# EAGLE design Xonik Waveformer v1.0 (EAGLE 6.5.0)
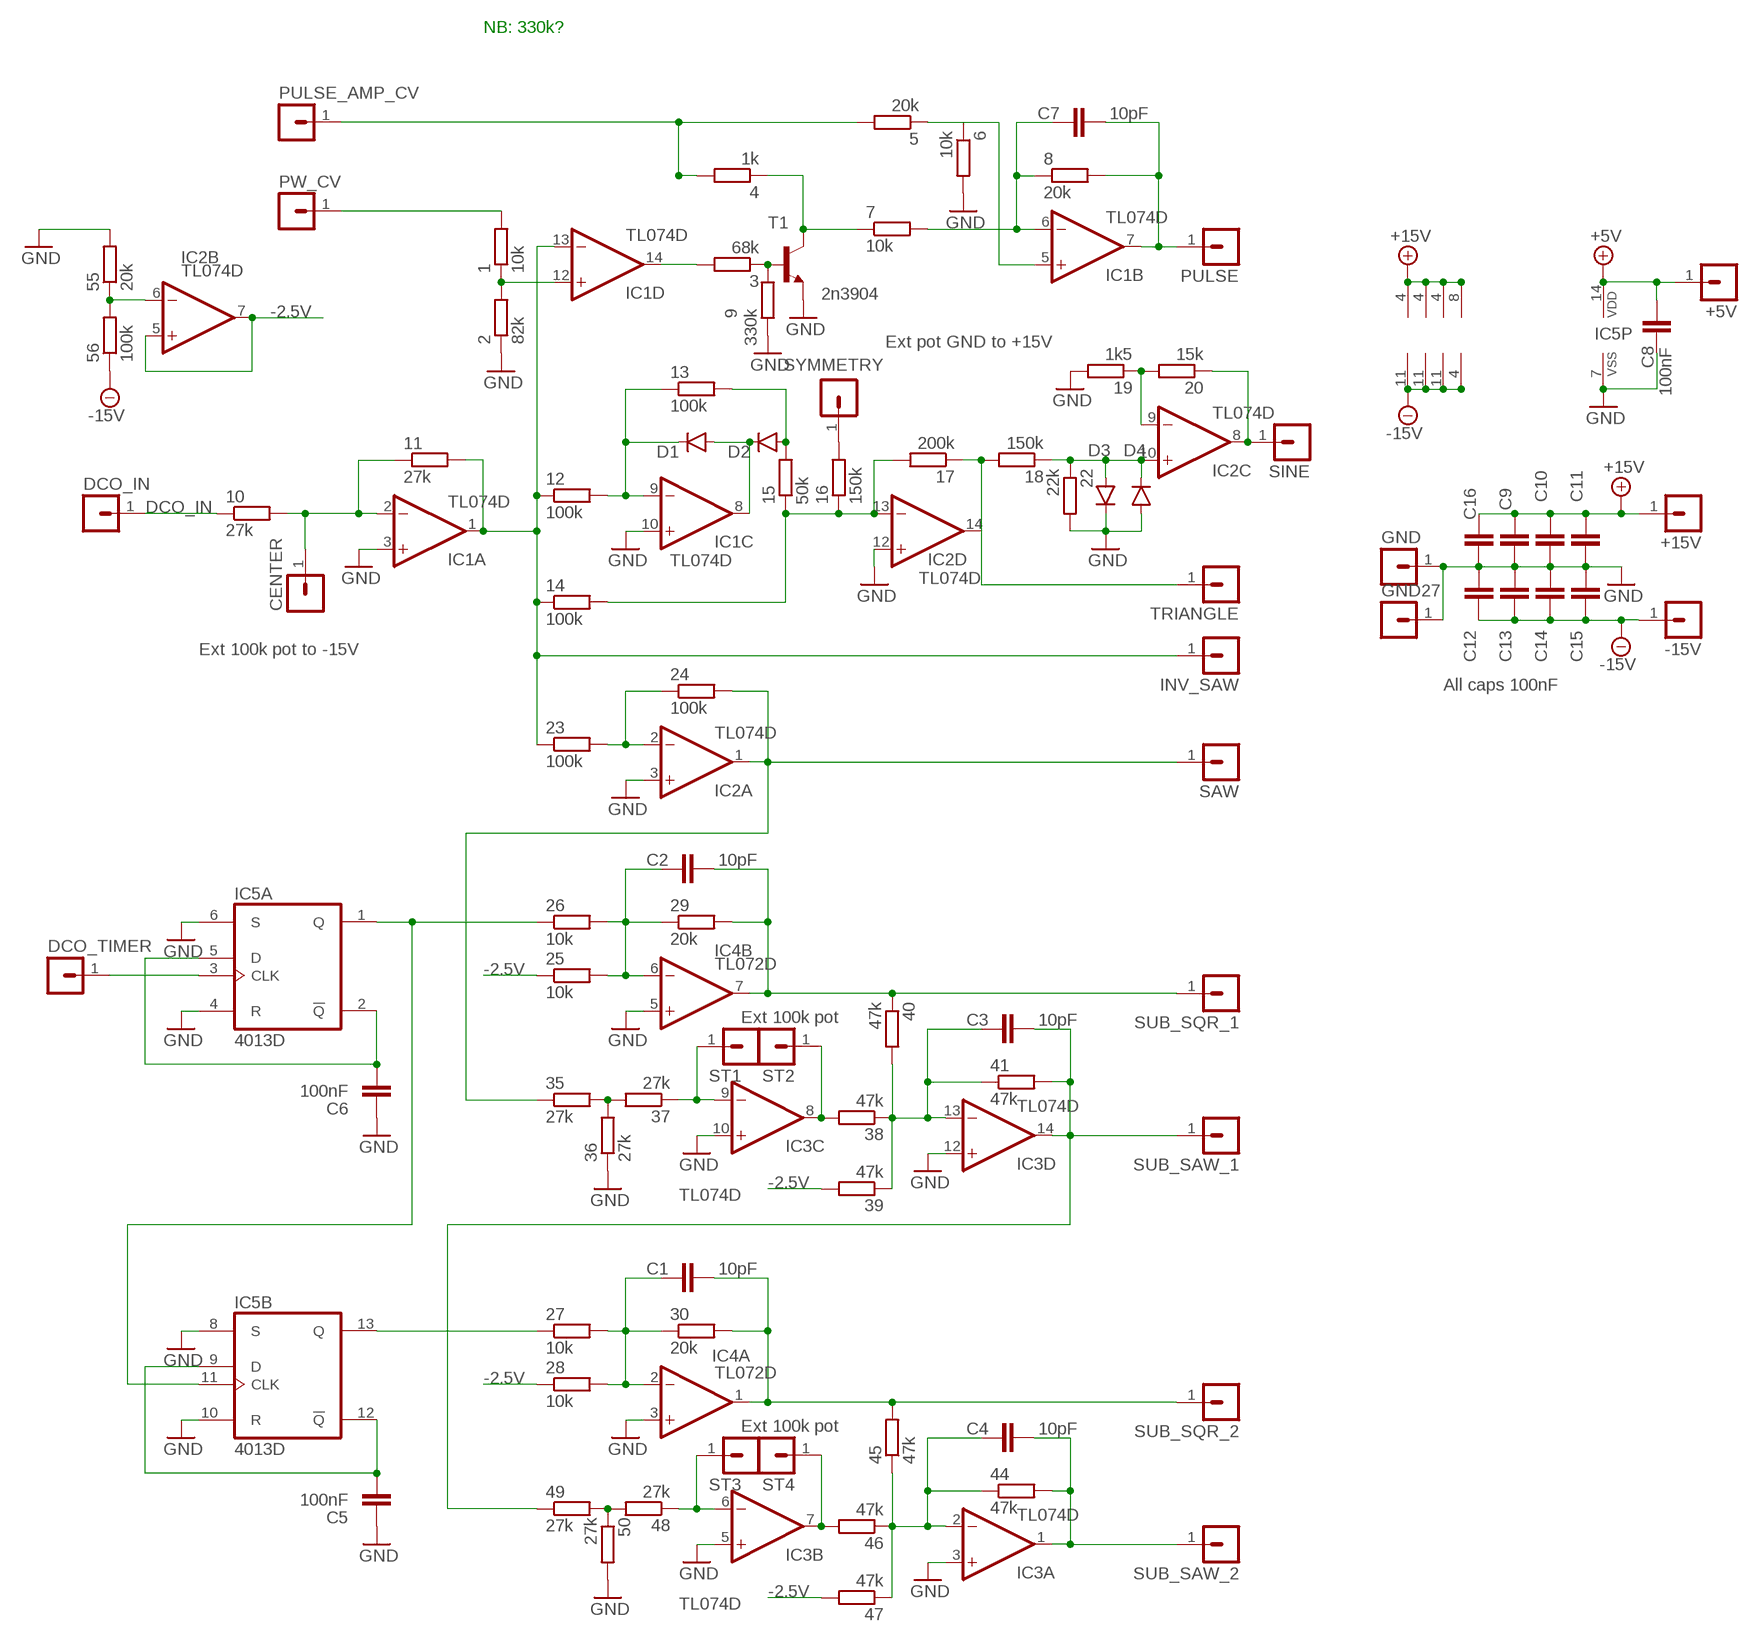
[diagram p0: schematic, sheet 1]

## Parts
1  10k  R-EU_R0805  [R0805]
2  82k  R-EU_R0805  [R0805]
3  68k  R-EU_R0805  [R0805]
4  1k  R-EU_R0805  [R0805]
5  20k  R-EU_R0805  [R0805]
6  10k  R-EU_R0805  [R0805]
7  10k  R-EU_R0805  [R0805]
8  20k  R-EU_R0805  [R0805]
9  330k  R-EU_R0805  [R0805]
10  27k  R-EU_R0805  [R0805]
11  27k  R-EU_R0805  [R0805]
12  100k  R-EU_R0805  [R0805]
13  100k  R-EU_R0805  [R0805]
14  100k  R-EU_R0805  [R0805]
15  50k  R-EU_R0805  [R0805]
16  150k  R-EU_R0805  [R0805]
17  200k  R-EU_R0805  [R0805]
18  150k  R-EU_R0805  [R0805]
19  1k5  R-EU_R0805  [R0805]
20  15k  R-EU_R0805  [R0805]
22  22k  R-EU_R0805  [R0805]
23  100k  R-EU_R0805  [R0805]
24  100k  R-EU_R0805  [R0805]
25  10k  R-EU_R0805  [R0805]
26  10k  R-EU_R0805  [R0805]
27  10k  R-EU_R0805  [R0805]
28  10k  R-EU_R0805  [R0805]
29  20k  R-EU_R0805  [R0805]
30  20k  R-EU_R0805  [R0805]
35  27k  R-EU_R0805  [R0805]
36  27k  R-EU_R0805  [R0805]
37  27k  R-EU_R0805  [R0805]
38  47k  R-EU_R0805  [R0805]
39  47k  R-EU_R0805  [R0805]
40  47k  R-EU_R0805  [R0805]
41  47k  R-EU_R0805  [R0805]
44  47k  R-EU_R0805  [R0805]
45  47k  R-EU_R0805  [R0805]
46  47k  R-EU_R0805  [R0805]
47  47k  R-EU_R0805  [R0805]
48  27k  R-EU_R0805  [R0805]
49  27k  R-EU_R0805  [R0805]
50  27k  R-EU_R0805  [R0805]
55  20k  R-EU_R0805  [R0805]
56  100k  R-EU_R0805  [R0805]
+5V  MA01-1JP  [SIP-PIN01-1J]
+15V  MA01-1JP  [SIP-PIN01-1J]
-15V  MA01-1JP  [SIP-PIN01-1J]
C1  10pF  C-EUC0805  [C0805]
C2  10pF  C-EUC0805  [C0805]
C3  10pF  C-EUC0805  [C0805]
C4  10pF  C-EUC0805  [C0805]
C5  100nF  C-EUC0805  [C0805]
C6  100nF  C-EUC0805  [C0805]
C7  10pF  C-EUC0805  [C0805]
C8  100nF  C-EUC0805  [C0805]
C9  100nF  C-EUC0603K  [C0603K]
C10  100nF  C-EUC0603K  [C0603K]
C11  100nF  C-EUC0603K  [C0603K]
C12  100nF  C-EUC0603K  [C0603K]
C13  100nF  C-EUC0603K  [C0603K]
C14  100nF  C-EUC0603K  [C0603K]
C15  100nF  C-EUC0603K  [C0603K]
C16  100nF  C-EUC0603K  [C0603K]
CENTER  MA01-1JP  [SIP-PIN01-1J]
D1  1N41480805  [D0805-J]
D2  1N41480805  [D0805-J]
D3  1N41480805  [D0805-J]
D4  1N41480805  [D0805-J]
DCO_IN  MA01-1JP  [SIP-PIN01-1J]
DCO_TIMER  MA01-1JP  [SIP-PIN01-1J]
GND  MA01-1JP  [SIP-PIN01-1J]
GND27  MA01-1JP  [SIP-PIN01-1J]
IC1  TL074D  [SO14]
IC2  TL074D  [SO14]
IC3  TL074D  [SO14]
IC4  TL072D  [SO08J]
IC5  4013D  [SO14J]
INV_SAW  MA01-1JP  [SIP-PIN01-1J]
PULSE  MA01-1JP  [SIP-PIN01-1J]
PULSE_AMP_CV  MA01-1JP  [SIP-PIN01-1J]
PW_CV  MA01-1JP  [SIP-PIN01-1J]
SAW  MA01-1JP  [SIP-PIN01-1J]
SINE  MA01-1JP  [SIP-PIN01-1J]
ST1  MA01-1JP  [SIP-PIN01-1J]
ST2  MA01-1JP  [SIP-PIN01-1J]
ST3  MA01-1JP  [SIP-PIN01-1J]
ST4  MA01-1JP  [SIP-PIN01-1J]
SUB_SAW_1  MA01-1JP  [SIP-PIN01-1J]
SUB_SAW_2  MA01-1JP  [SIP-PIN01-1J]
SUB_SQR_1  MA01-1JP  [SIP-PIN01-1J]
SUB_SQR_2  MA01-1JP  [SIP-PIN01-1J]
SYMMETRY  MA01-1JP  [SIP-PIN01-1J]
T1  2n3904  MMBT3904LT1-NPN-SOT23-BEC  [SOT23-BEC]
TRIANGLE  MA01-1JP  [SIP-PIN01-1J]

## Nets
+5V: +5V.1 C8.2 IC5.14(P:VDD)
+15V: +15V.1 C9.2 C10.2 C11.2 C16.2 IC1.4(P:V+) IC2.4(P:V+) IC3.4(P:V+) IC4.8(P:V+)
-2.5V: 25.1 28.1 39.2 47.2 IC2.5(B:+IN) IC2.7(B:OUT)
-15V: 56.1 -15V.1 C12.1 C13.1 C14.1 C15.1 IC1.11(P:V-) IC2.11(P:V-) IC3.11(P:V-) IC4.4(P:V-)
AMP_CV: 4.2 5.2 PULSE_AMP_CV.1
DCO_IN: 10.1 DCO_IN.1
GND: 2.1 6.2 9.2 19.2 22.2 36.1 50.2 55.2 C5.1 C6.1 C8.1 C9.1 C10.1 C11.1 C12.2 C13.2 C14.2 C15.2 C16.1 D3.C D4.A GND27.1 GND.1 IC1.3(A:+IN) IC1.10(C:+IN) IC2.3(A:+IN) IC2.12(D:+IN) IC3.3(A:+IN) IC3.5(B:+IN) IC3.10(C:+IN) IC3.12(D:+IN) IC4.3(A:+IN) IC4.5(B:+IN) IC5.4(A:R) IC5.6(A:S) IC5.7(P:VSS) IC5.8(B:S) IC5.10(B:R) T1.E
N$1: 1.1 2.2 IC1.12(D:+IN)
N$2: 3.2 IC1.14(D:OUT)
N$3: 3.1 9.1 T1.B
N$4: 4.1 7.1 T1.C
N$5: 5.1 6.1 IC1.5(B:+IN)
N$6: 7.2 8.1 C7.1 IC1.6(B:-IN)
N$7: 8.2 C7.2 IC1.7(B:OUT) PULSE.1
N$9: 11.2 12.1 14.1 23.1 IC1.1(A:OUT) IC1.13(D:-IN) INV_SAW.1
N$10: 10.2 11.1 CENTER.1 IC1.2(A:-IN)
N$11: 12.2 13.1 D1.C IC1.9(C:-IN)
N$12: D1.A D2.C IC1.8(C:OUT)
N$13: 13.2 15.2 D2.A
N$14: 14.2 15.1 16.1 17.2 IC2.13(D:-IN)
N$15: 23.2 24.1 IC2.2(A:-IN)
N$16: 24.2 35.1 IC2.1(A:OUT) SAW.1
N$17: 29.2 40.1 C2.2 IC4.7(B:OUT) SUB_SQR_1.1
N$18: 30.2 45.2 C1.2 IC4.1(A:OUT) SUB_SQR_2.1
N$19: 25.2 26.2 29.1 C2.1 IC4.6(B:-IN)
N$20: 46.2 IC3.7(B:OUT) ST4.1
N$21: 48.2 49.2 50.1
N$22: 27.2 28.2 30.1 C1.1 IC4.2(A:-IN)
N$23: 35.2 36.2 37.2
N$24: 37.1 IC3.9(C:-IN) ST1.1
N$26: 38.1 39.1 40.2 41.1 C3.1 IC3.13(D:-IN)
N$27: 41.2 49.1 C3.2 IC3.14(D:OUT) SUB_SAW_1.1
N$28: 48.1 IC3.6(B:-IN) ST3.1
N$29: 44.1 45.1 46.1 47.1 C4.1 IC3.2(A:-IN)
N$30: 44.2 C4.2 IC3.1(A:OUT) SUB_SAW_2.1
N$31: C6.2 IC5.2(A:!Q) IC5.5(A:D)
N$32: 26.1 IC5.1(A:Q) IC5.11(B:CLK)
N$33: 55.1 56.2 IC2.6(B:-IN)
N$34: C5.2 IC5.9(B:D) IC5.12(B:!Q)
N$35: 27.1 IC5.13(B:Q)
N$36: 19.1 20.2 IC2.9(C:-IN)
N$37: 16.2 SYMMETRY.1
N$38: 17.1 18.2 IC2.14(D:OUT) TRIANGLE.1
N$39: 18.1 22.1 D3.A D4.C IC2.10(C:+IN)
N$40: 20.1 IC2.8(C:OUT) SINE.1
N$41: 38.2 IC3.8(C:OUT) ST2.1
PW_CV: 1.2 PW_CV.1
SQR: DCO_TIMER.1 IC5.3(A:CLK)

## Notes on the sheet
- NB: 330k?
- Ext pot GND to +15V
- Ext 100k pot to -15V
- All caps 100nF
- Ext 100k pot
- Ext 100k pot

## Library data of the parts
1-20 22-30 35-41 44-50 55 56 = resistor:R-EU_: RESISTOR, European symbol
+5V +15V -15V CENTER DCO_IN DCO_TIMER GND GND27 INV_SAW PULSE PULSE_AMP_CV PW_CV SAW SINE ST1-ST4 SUB_SAW_1 SUB_SAW_2 SUB_SQR_1 SUB_SQR_2 SYMMETRY TRIANGLE = joakim:MA01-1J: PIN HEADER
C1-C16 = resistor:C-EU: CAPACITOR, European symbol
D1-D4 = joakim:1N4148: DIODE high speed (Philips)
IC1-IC3 = linear:TL074: OP AMP
IC4 = joakim:TL072: OP AMP
IC5 = joakim:4013: Dual D FLIP FLOP, set/reset
T1 = transistor-neu-to92:*-NPN-: NPN Transistror

## Board
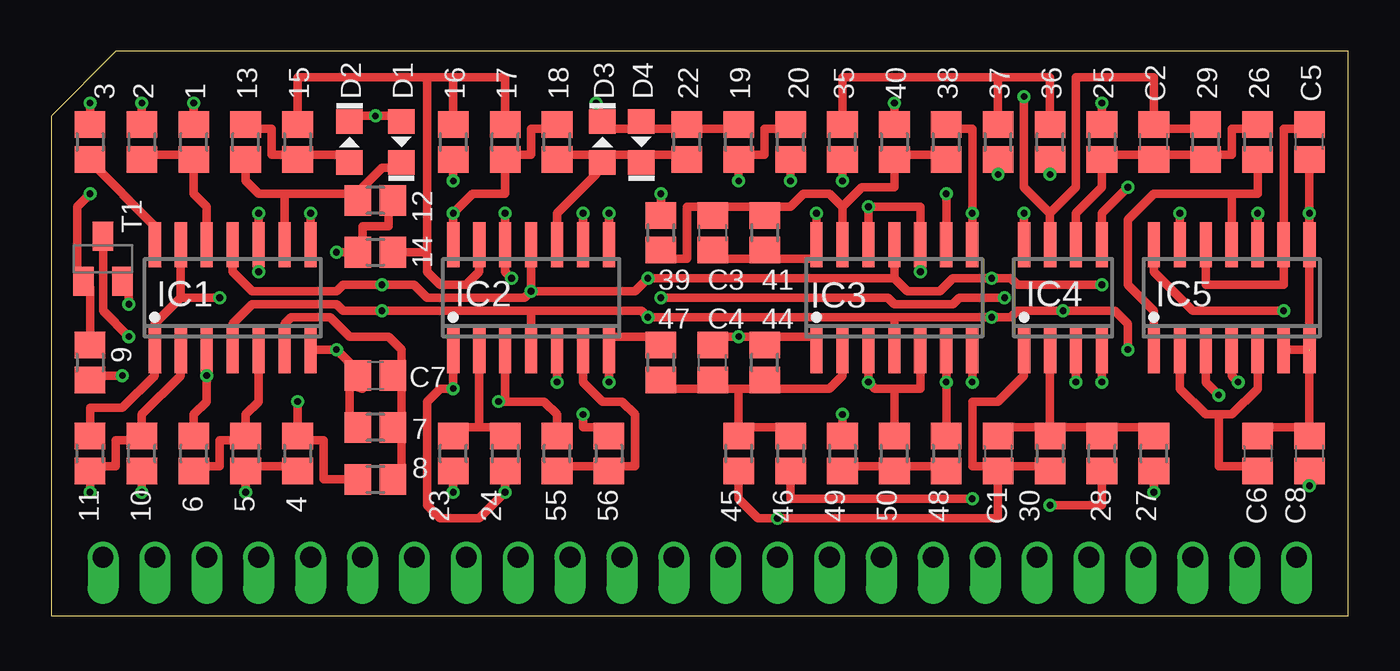
[diagram p1: board, top side]
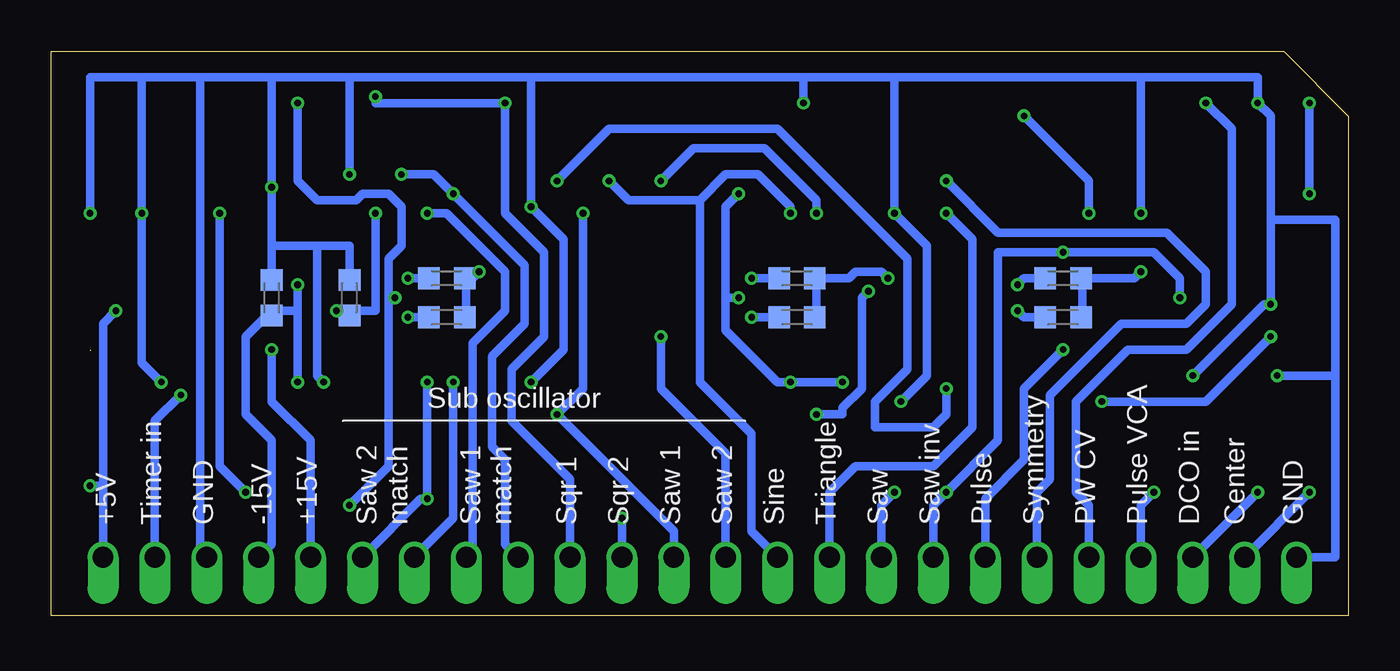
[diagram p2: board, bottom side, seen from below]

Size 63.5 x 27.62 mm. Coordinates in mm from the lower left corner, seen from the top.
Outline: 0,0 63.5,0 63.5,27.61 3.49,27.62 3.17,27.61 0,24.43 0,0
Copper layers (1*16): Top 0.035mm / dielectric 1.5mm / Bottom 0.035mm
Design rules "dirt_cheap_dirty_boards.v1": minimum track width 5mil, minimum drill 12mil, track to track 5mil, track to pad 5mil, pad to pad 5mil, via to via 5mil, smd to smd 0mil, copper to edge 10mil, drill to drill 10mil, minimum pad ring 10mil, minimum via ring 6mil, stop-mask expansion 2mil, vias tented up to drill 25mil, thermal gap 10mil

### Footprints (pad centres in the part's own frame; a part is rotated, then mirrored left to right if it is on the bottom)
R0805 = smd 1.3 x 1.5: 1 -0.85,0; 2 0.85,0
SIP-PIN01-1J = drill 1.016 offset: 1 0,0
C0805 = smd 1.3 x 1.5: 1 -0.85,0; 2 0.85,0
C0603K = smd 1.05 x 1.08: 1 -0.875,0; 2 0.875,0
D0805-J = smd 1.2 x 1.3: A -1,0; C 1,0
SO14 = smd 0.6 x 2.2: 1 -3.81,-2.6; 2 -2.54,-2.6; 3 -1.27,-2.6; 4 0,-2.6; 5 1.27,-2.6; 6 2.54,-2.6; 7 3.81,-2.6; 8 3.81,2.6; 9 2.54,2.6; 10 1.27,2.6; 11 0,2.6; 12 -1.27,2.6; 13 -2.54,2.6; 14 -3.81,2.6
SO08J = smd 0.6 x 2.2: 1 -1.905,-2.6; 2 -0.635,-2.6; 3 0.635,-2.6; 4 1.905,-2.6; 5 1.905,2.6; 6 0.635,2.6; 7 -0.635,2.6; 8 -1.905,2.6
SO14J = smd 0.6 x 2.2: 1 -3.81,-2.6; 2 -2.54,-2.6; 3 -1.27,-2.6; 4 0,-2.6; 5 1.27,-2.6; 6 2.54,-2.6; 7 3.81,-2.6; 8 3.81,2.6; 9 2.54,2.6; 10 1.27,2.6; 11 0,2.6; 12 -1.27,2.6; 13 -2.54,2.6; 14 -3.81,2.6
SOT23-BEC = smd 1 x 1.4: B -0.95,-1.1; C 0,1.1; E 0.95,-1.1

### Placement (x,y rotation side)
1  6.99,23.18 90 top
2  4.45,23.18 270 top
3  1.91,23.18 270 top
4  12.06,7.94 270 top
5  9.53,7.94 270 top
6  6.99,7.94 90 top
7  15.88,6.67 0 top
8  15.88,9.21 180 top
9  1.91,12.38 270 top
10  4.45,7.94 90 top
11  1.91,7.94 90 top
12  15.88,20.32 180 top
13  9.53,23.18 90 top
14  15.88,17.78 0 top
15  12.06,23.18 270 top
16  19.68,23.18 270 top
17  22.23,23.18 90 top
18  24.77,23.18 90 top
19  33.66,23.18 90 top
20  36.2,23.18 90 top
22  31.11,23.18 90 top
23  19.68,7.94 90 top
24  22.23,7.94 270 top
25  51.44,23.18 270 top
26  59.05,23.18 90 top
27  53.98,7.94 90 top
28  51.44,7.94 90 top
29  56.52,23.18 90 top
30  48.9,7.94 270 top
35  38.73,23.18 90 top
36  48.9,23.18 90 top
37  46.35,23.18 90 top
38  43.81,23.18 90 top
39  29.84,18.73 90 top
40  41.27,23.18 270 top
41  34.92,18.73 270 top
44  34.92,12.38 90 top
45  33.66,7.94 270 top
46  36.2,7.94 270 top
47  29.84,12.38 90 top
48  43.81,7.94 270 top
49  38.73,7.94 270 top
50  41.27,7.94 90 top
55  24.77,7.94 90 top
56  27.3,7.94 270 top
+5V  60.96,2.86 0 top
+15V  50.8,2.86 0 top
-15V  53.34,2.86 0 top
C1  46.35,7.94 270 top
C2  53.98,23.18 90 top
C3  32.38,18.73 270 top
C4  32.38,12.38 90 top
C5  61.59,23.18 90 top
C6  59.05,7.94 270 top
C7  15.88,11.75 180 top
C8  61.59,7.94 270 top
C9  44.13,14.61 180 bottom
C10  26.99,14.61 180 bottom
C11  13.97,14.61 180 bottom
C12  52.7,15.56 90 bottom
C13  44.13,16.51 0 bottom
C14  26.99,16.51 0 bottom
C15  13.97,16.51 0 bottom
C16  48.9,15.56 270 bottom
CENTER  5.08,2.86 0 top
D1  17.14,23.18 270 top
D2  14.61,23.18 90 top
D3  26.99,23.18 90 top
D4  28.89,23.18 270 top
DCO_IN  7.62,2.86 0 top
DCO_TIMER  58.42,2.86 0 top
GND  55.88,2.86 0 top
GND27  2.54,2.86 0 top
IC1  8.89,15.56 0 top
IC2  23.5,15.56 0 top
IC3  41.27,15.56 0 top
IC4  49.53,15.56 0 top
IC5  57.78,15.56 0 top
INV_SAW  20.32,2.86 0 top
PULSE  17.78,2.86 0 top
PULSE_AMP_CV  10.16,2.86 0 top
PW_CV  12.7,2.86 0 top
SAW  22.86,2.86 0 top
SINE  27.94,2.86 0 top
ST1  40.64,2.86 0 top
ST2  43.18,2.86 0 top
ST3  45.72,2.86 0 top
ST4  48.26,2.86 0 top
SUB_SAW_1  33.02,2.86 0 top
SUB_SAW_2  30.48,2.86 0 top
SUB_SQR_1  38.1,2.86 0 top
SUB_SQR_2  35.56,2.86 0 top
SYMMETRY  15.24,2.86 0 top
T1  2.54,17.46 0 top
TRIANGLE  25.4,2.86 0 top

### Tracks (layer width: path | path; a pad name or v marks a point on that pad's centre or on a via)
+5V  (via drill 0.33)
  Top 0.406: v60.33,14.92 55.88,14.92 53.98,16.83 IC5.14 | C8.2 v61.59,6.35
  Bottom 0.406: +5V.1 60.96,6.35 | 60.96,6.35 60.96,14.29 v60.33,14.92 | v61.59,6.35 60.96,6.35
+15V  (via drill 0.33)
  Top 0.406: IC1.4 8.89,14.29 9.84,15.24 13.97,15.24 14.29,14.92 v16.19,14.92 23.5,14.92 | 23.5,14.92 28.89,14.92 v29.21,14.61 41.27,14.61 | 41.27,14.61 v46.04,14.61 46.99,14.61 47.31,14.92 v49.53,14.92 52.07,14.92 52.7,14.29 v52.7,13.02 | IC2.4 23.5,14.92 | IC3.4 41.27,14.61 | IC4.8 v47.62,19.68
  Bottom 0.406: +15V.1 50.8,8.57 52.7,10.48 v52.7,13.02 | v47.62,19.68 47.62,14.92 48.34,14.92 | 48.34,14.92 v49.53,14.92 | C11.2 15.88,14.61 v16.19,14.92 | v29.21,14.61 C10.2 | 45.09,14.92 C9.2 v46.04,14.61 | 48.34,14.92 C16.2
-2.5V  (via drill 0.33)
  Top 0.406: v29.84,15.56 40.96,15.56 41.27,15.24 44.13,15.24 44.45,15.56 v46.67,15.56 | 28.1 51.44,5.4 v48.9,5.4 | v51.44,25.08 25.1 | v27.3,11.43 IC2.7 27.3,13.65 29.84,13.65 47.2 | 39.2 v29.84,20.64 | IC2.5 v24.77,11.43
  Bottom 0.406: 30.48,15.56 30.48,20 v29.84,20.64 | v48.9,5.4 46.99,7.3 46.99,15.56 | v46.67,15.56 46.99,15.56 | 46.99,15.56 46.99,17.46 46.35,18.1 46.35,20 46.99,20.64 48.26,20.64 48.58,20.32 50.48,20.32 51.44,21.27 v51.44,25.08 | 30.48,15.56 30.48,13.97 27.94,11.43 v27.3,11.43 v24.77,11.43 | 30.48,15.56 v29.84,15.56
-15V  (via drill 0.33)
  Top 0.406: IC1.11 8.89,16.83 9.84,15.88 13.97,15.88 14.29,16.19 v16.19,16.19 17.78,16.19 18.41,15.56 23.18,15.56 v23.5,15.88 | v23.5,15.88 28.57,15.88 v29.21,16.51 41.27,16.51 | 41.27,16.51 41.91,15.88 43.5,15.88 44.13,16.51 v46.04,16.51 46.99,16.51 47.31,16.19 v51.44,16.19 | IC3.11 41.27,16.51 | IC2.11 v23.5,15.88 | 56.1 27.3,9.21 26.04,9.21 v26.04,9.84 | IC4.4 v51.44,11.43
  Bottom 0.406: v26.04,9.84 24.77,9.84 24.77,10.16 23.81,11.11 23.81,15.56 v23.5,15.88 | -15V.1 52.7,3.49 52.7,8.57 53.98,9.84 53.98,13.65 52.7,14.92 | 52.7,14.92 51.44,14.92 v51.44,16.19 v51.44,11.43 | C15.1 15.88,16.51 v16.19,16.19 | v29.21,16.51 C14.1 | C13.1 v46.04,16.51 | 52.7,14.92 C12.1
AMP_CV  (via drill 0.33)
  Top 0.406: v9.53,6.03 5.2 9.95,7.3 12.06,7.3 4.2
  Bottom 0.406: v9.53,6.03 10.16,5.4 PULSE_AMP_CV.1
DCO_IN  (via drill 0.33)
  Top 0.406: 10.1 v4.45,6.03
  Bottom 0.406: v4.45,6.03 DCO_IN.1
GND  (via drill 0.33)  (1 unrouted)
  Top 0.406: IC3.12 v40.01,20 42.55,20 IC3.10 v42.55,16.83 | IC3.5 42.55,11.11 41.27,11.11 | IC3.3 v40.01,11.43 40.32,11.11 41.27,11.11 | C5.1 v61.59,19.68 IC5.8 61.59,13.02 60.33,13.02 IC5.6 | v52.7,20.95 51.44,19.68 IC4.5 | 41.27,11.11 50.2 | v22.23,19.68 IC2.12 22.23,16.83 v22.54,16.51 | IC2.3 22.23,10.48 v21.91,10.48 24.13,10.48 24.77,9.84 55.2 | IC5.10 v59.05,19.68 | 36.1 v48.9,21.59 | IC4.3 v50.16,11.43 | 29.21,23.81 26.99,23.81 D3.C v26.67,25.08 | 29.21,23.81 31.43,23.81 | D4.A 29.21,23.81 | 22.2 31.43,23.81 | 31.43,23.81 33.66,23.81 19.2 | IC5.4 57.78,11.75 v58.1,11.43 | 6.2 6.99,9.84 7.62,10.48 IC1.3 v7.62,11.75 | v10.16,19.68 IC1.10 v10.16,16.83 | 2.1 v4.45,25.08 | T1.E 3.64,16.36 3.81,16.19 v3.81,15.24 | 9.2 1.91,11.75 v3.49,11.75 | C6.1 59.05,8.89 59.37,9.21 61.17,9.21 | 61.17,9.21 C8.1 | 61.17,9.21 61.59,9.21 IC5.7
  Bottom 0.406: v61.59,19.68 61.59,26.35 59.05,26.35 | 59.05,26.35 56.2,26.35 | 56.2,26.35 52.7,26.35 | 52.7,26.35 v52.7,20.95 52.7,18.1 | 40.01,26.35 v40.01,20 38.42,18.41 38.42,13.02 v40.01,11.43 | 40.01,26.35 48.9,26.35 | 48.9,26.35 52.7,26.35 | 26.67,26.35 40.01,26.35 | v21.91,10.48 20.64,11.75 20.64,18.1 v22.23,19.68 22.23,26.35 | 59.05,26.35 v59.05,19.68 59.05,12.38 v58.1,11.43 | GND.1 56.2,3.17 56.2,26.35 | v48.9,21.59 48.9,26.35 | v50.16,11.43 50.48,11.75 50.48,18.1 | v10.16,19.68 10.16,26.35 | 10.16,26.35 22.23,26.35 | 22.23,26.35 26.67,26.35 | 26.67,26.35 v26.67,25.08 | 10.16,26.35 4.45,26.35 v4.45,25.08 3.81,24.45 3.81,19.37 | 3.81,19.37 v3.81,15.24 4.13,15.24 v7.62,11.75 | GND27.1 0.64,2.86 0.64,11.75 | v3.49,11.75 0.64,11.75 | v10.16,16.83 10.48,16.51 C15.2 13.02,16.43 13.02,14.61 C11.1 | v22.54,16.51 22.86,16.83 24.13,16.83 24.45,16.51 C14.2 26.04,16.43 26.04,14.61 C10.1 | C9.1 43.18,14.68 43.18,16.51 C13.2 42.86,16.51 v42.55,16.83 | C16.1 48.9,18.1 50.48,18.1 | C12.2 52.7,18.1 | 52.7,18.1 50.48,18.1 | 0.64,11.75 0.64,19.37 3.81,19.37
N$1
  Top 0.406: IC1.12 7.62,20 6.99,20.64 1.1 6.99,22.54 4.87,22.54 2.2
N$2
  Top 0.406: 3.2 1.91,22.23 5.08,19.05 IC1.14
N$3  (via drill 0.33)
  Top 0.406: 9.1 1.91,16.05 T1.B 1.59,16.51 1.27,16.83 1.27,20 v1.91,20.64 | v1.91,25.08 3.1
  Bottom 0.406: v1.91,20.64 v1.91,25.08
N$4  (via drill 0.33)
  Top 0.406: T1.C 2.54,14.92 v3.81,13.65 | v12.06,10.48 4.1 12.06,8.57 13.34,8.57 13.34,6.67 7.1
  Bottom 0.406: v3.81,13.65 6.99,10.48 v12.06,10.48
N$5
  Top 0.406: 6.1 6.99,7.3 8.26,7.3 8.26,8.57 9.53,8.57 5.1 9.53,9.84 10.16,10.48 IC1.5
N$6
  Top 0.406: IC1.6 11.43,14.29 11.75,14.61 13.65,14.61 14.61,13.65 16.51,13.65 17.14,13.02 17.14,12.17 | 17.14,12.17 17.14,9.63 8.1 17.14,9.21 17.14,7.09 7.2 | 17.14,12.17 C7.1
N$7  (via drill 0.33)
  Top 0.406: 15.24,11.11 15.24,11.75 14.03,12.96 13.97,12.96 v13.97,13.02 12.76,13.02 IC1.7 | 15.24,11.11 14.61,11.33 | 14.61,11.33 C7.2 15.24,11.11 | 14.61,11.33 14.61,9.63 8.2
  Bottom 0.406: PULSE.1 17.78,5.71 15.88,7.62 15.88,11.11 v13.97,13.02
N$9  (via drill 0.33)
  Top 0.406: 11.2 1.91,10.16 3.49,10.16 5.08,11.75 IC1.1 5.08,14.29 6.35,15.56 | 6.35,15.56 IC1.13 | 14.1 15.24,18.1 | 15.24,18.1 15.24,19.05 16.51,19.05 16.51,20.22 12.1 | 15.24,18.1 15.24,17.78 v13.97,17.78 | v8.26,15.56 6.35,15.56 | 23.1 v19.68,6.03
  Bottom 0.406: v8.26,15.56 8.26,16.51 9.53,17.78 v13.97,17.78 17.14,17.78 17.14,8.57 v19.68,6.03 20.32,5.4 INV_SAW.1
N$10  (via drill 0.33)
  Top 0.406: IC1.2 6.35,11.75 4.45,9.84 10.2 4.45,8.57 3.17,8.57 3.17,7.3 1.91,7.3 11.1 v1.91,6.03
  Bottom 0.406: v1.91,6.03 CENTER.1
N$11
  Top 0.406: 13.1 9.53,21.27 10.16,20.64 11.43,20.64 | 11.43,20.64 IC1.9 | 15.24,20.64 15.03,20.42 12.2 | 15.24,20.64 11.43,20.64 | 15.24,20.64 15.24,20.95 16.19,21.91 16.88,21.91 D1.C
N$12  (via drill 0.33)
  Top 0.406: D2.C 14.61,24.45 v15.88,24.45 16.88,24.45 D1.A | v12.7,19.68 IC1.8
  Bottom 0.406: v15.88,24.45 12.7,21.27 v12.7,19.68
N$13
  Top 0.406: D2.A 14.34,22.54 12.06,22.54 15.2 11.64,22.54 10.79,22.54 10.79,23.81 9.53,23.81 13.2
N$14
  Top 0.406: 15.1 12.06,26.35 18.41,26.35 | 18.41,26.35 19.68,26.35 | 19.68,26.35 16.1 | 17.2 22.23,26.35 19.68,26.35 | 14.2 18.41,17.78 | 18.41,17.78 18.41,26.35 | IC2.13 20.95,16.83 20.32,16.19 19.05,16.19 18.41,16.83 18.41,17.78
N$15
  Top 0.406: 23.2 19.68,9.21 20.95,9.21 | 24.1 21.8,9.21 20.95,9.21 | 20.95,9.21 IC2.2
N$16  (via drill 0.33)
  Top 0.406: 24.2 v22.23,6.03 20.95,4.76 19.05,4.76 18.41,5.4 18.41,10.48 19.05,11.11 v19.68,11.11 IC2.1 | 35.1 v38.73,21.27
  Bottom 0.406: v19.68,11.11 19.68,9.84 20.32,9.21 23.18,9.21 23.18,10.48 21.59,12.06 21.59,17.46 27.94,23.81 36.2,23.81 v38.73,21.27 | v22.23,6.03 22.86,5.4 SAW.1
N$17  (via drill 0.33)
  Top 0.406: 29.2 56.2,23.81 54.08,23.81 C2.2 53.98,26.35 50.16,26.35 50.16,20.95 48.9,19.68 | IC4.7 48.9,19.68 | 40.85,24.03 40.1 v41.27,25.08 | 48.9,19.68 47.62,20.95 v47.62,25.4
  Bottom 0.406: SUB_SQR_1.1 38.1,6.67 40.96,9.53 40.96,12.06 39.37,13.65 39.37,17.78 41.27,19.68 v41.27,25.08 47.62,25.08 v47.62,25.4
N$18  (via drill 0.33)
  Top 0.406: IC4.1 47.62,11.75 46.35,10.48 45.09,10.48 45.09,7.3 45.94,7.3 C1.2 | 45.2 33.66,5.71 34.61,4.76 v35.56,4.76 46.35,4.76 C1.2 | C1.2 46.35,6.99 46.67,7.3 48.48,7.3 30.2
  Bottom 0.406: SUB_SQR_2.1 v35.56,4.76
N$19
  Top 0.406: 56.52,22.54 54.29,22.54 | C2.1 54.29,22.54 | 54.29,22.54 51.54,22.54 25.2 51.44,20.95 50.16,19.68 IC4.6 | 29.1 56.52,22.54 | 56.52,22.54 57.78,22.54 57.78,23.81 59.05,23.81 26.2
N$20  (via drill 0.33)
  Top 0.406: 46.2 36.2,5.71 v45.09,5.71 | IC3.7 v45.09,11.43
  Bottom 0.406: v45.09,11.43 v45.09,5.71 45.4,5.71 ST4.1
N$21
  Top 0.406: 48.2 43.81,7.3 41.7,7.3 50.1 41.06,7.3 38.73,7.3 49.2
N$22
  Top 0.406: 48.9,9.21 IC4.2 | C1.1 46.35,9.21 48.9,9.21 | 27.2 53.55,9.21 51.44,9.21 | 48.9,9.21 30.1 48.9,8.89 49.21,9.21 51.44,9.21 | 28.2 51.44,9.21
N$23
  Top 0.406: 36.2 48.9,26.35 46.35,26.35 | 46.35,26.35 38.73,26.35 35.2 | 37.2 46.35,26.35
N$24  (via drill 0.33)
  Top 0.406: IC3.9 v43.81,20.64 | 37.1 v46.35,21.59
  Bottom 0.406: ST1.1 41.27,3.49 41.27,7.62 41.91,8.26 41.91,12.7 40.32,14.29 40.32,17.14 v43.81,20.64 44.77,21.59 v46.35,21.59
N$26
  Top 0.406: 38.1 43.81,22.54 41.7,22.54 40.2 41.27,20.95 39.69,20.95 38.73,20 | IC3.13 38.73,20 | 38.73,20 38.1,20.64 36.83,20.64 36.2,20 34.92,20 | 34.92,20 32.8,20 C3.1 32.38,20 31.11,20 31.11,17.46 29.84,17.46 39.1 | 41.1 34.92,20
N$27  (via drill 0.33)
  Top 0.406: 35.34,17.46 41.2 34.92,17.46 | 34.92,17.46 32.8,17.46 C3.2 | v37.47,19.68 IC3.14 37.47,17.46 35.34,17.46 | 35.34,17.46 34.92,17.46 | 49.1 v38.73,9.84
  Bottom 0.406: v37.47,19.68 37.47,11.11 v38.73,9.84 33.02,4.13 SUB_SAW_1.1
N$28  (via drill 0.33)
  Top 0.406: IC3.6 v43.81,11.43 48.1 43.81,8.57
  Bottom 0.406: v43.81,11.43 43.81,4.76 ST3.1
N$29
  Top 0.406: 46.1 36.2,9.21 34.08,9.21 45.1 33.66,11.11 | IC3.2 38.73,11.75 38.1,11.11 34.92,11.11 | 47.1 29.84,11.11 31.96,11.11 C4.1 32.38,11.11 33.66,11.11 | 33.66,11.11 34.51,11.11 | 34.51,11.11 44.1 34.92,11.11 | 34.92,11.11 34.51,11.11
N$30  (via drill 0.33)
  Top 0.406: C4.2 32.38,13.65 34.51,13.65 44.2 34.92,13.65 v33.66,13.65 37.47,13.65 IC3.1
  Bottom 0.406: v33.66,13.65 33.66,11.11 30.48,7.94 SUB_SAW_2.1
N$31
  Top 0.406: C6.2 59.05,7.3 57.15,7.3 57.15,9.84 | 57.15,9.84 57.78,9.84 59.05,11.11 IC5.5 | IC5.2 55.24,11.11 56.52,9.84 57.15,9.84
N$32
  Top 0.406: IC5.11 57.78,20.64 | 57.78,20.64 59.05,20.64 26.1 | IC5.1 53.98,14.92 52.7,16.19 52.7,19.37 53.98,20.64 57.78,20.64
N$33
  Top 0.406: 55.1 25.18,7.3 27.3,7.3 56.2 27.73,7.3 28.57,7.3 28.57,9.84 27.94,10.48 26.99,10.48 26.04,11.43 IC2.6
N$34
  Top 0.406: C5.2 61.59,23.81 60.33,23.81 IC5.9 60.33,16.19 56.52,16.19 IC5.12
N$35  (via drill 0.33)
  Top 0.406: 27.1 v53.98,6.03 | v55.24,19.68 IC5.13
  Bottom 0.406: v53.98,6.03 55.24,7.3 v55.24,19.68
N$36  (via drill 0.33)
  Top 0.406: IC2.9 v26.04,19.68 | 20.2 36.2,23.81 34.92,23.81 34.92,22.54 34.29,22.54 19.1 v33.66,21.27
  Bottom 0.406: v26.04,19.68 26.04,20.32 28.57,22.86 32.07,22.86 v33.66,21.27
N$37  (via drill 0.33)
  Top 0.406: 16.2 v19.68,21.27
  Bottom 0.406: v19.68,21.27 17.14,18.73 8.89,18.73 6.99,16.83 6.99,15.24 7.94,14.29 11.11,14.29 14.61,10.79 14.61,6.67 15.24,6.03 SYMMETRY.1
N$38  (via drill 0.33)
  Top 0.406: IC2.14 v19.68,19.68 20.64,20.64 22.23,20.64 17.1 22.64,22.54 23.5,22.54 23.5,23.81 24.77,23.81 18.2
  Bottom 0.406: TRIANGLE.1 25.4,6.03 24.13,7.3 20.32,7.3 18.41,9.21 18.41,18.41 v19.68,19.68
N$39
  Top 0.406: IC2.10 24.77,19.68 26.67,21.59 D3.A | D3.A 26.67,22.54 28.57,22.54 | 29.26,22.54 D4.C 28.57,22.54 | 28.57,22.54 29.26,22.54 | 29.26,22.54 31.01,22.54 22.1 | 18.1 24.77,22.54 26.4,22.54 D3.A
N$40  (via drill 0.33)
  Top 0.406: v27.3,19.68 IC2.8 | 20.1 v36.2,21.27
  Bottom 0.406: SINE.1 29.21,4.13 29.21,8.89 31.75,11.43 31.75,20.32 | 31.75,20.32 30.48,21.59 28.89,21.59 27.3,20 v27.3,19.68 | v36.2,21.27 35.24,20.32 31.75,20.32
N$41  (via drill 0.33)
  Top 0.406: 38.2 44.23,23.81 45.09,23.81 v45.09,19.68 IC3.8
  Bottom 0.406: v45.09,19.68 44.13,19.68 41.27,16.83 41.27,14.92 42.86,13.34 42.86,3.49 ST2.1
PW_CV  (via drill 0.33)
  Top 0.406: 1.2 v6.99,25.08
  Bottom 0.406: v6.99,25.08 5.71,23.81 5.71,15.24 7.94,13.02 10.79,13.02 13.34,10.48 13.34,6.03 12.7,5.4 PW_CV.1
SQR  (via drill 0.33)
  Top 0.406: IC5.3 56.52,11.43 v57.15,10.79
  Bottom 0.406: v57.15,10.79 58.42,9.53 DCO_TIMER.1

### Text on the board
bNames: Sub oscillator | GND | Center | DCO in | Pulse VCA | PW CV | Symmetry | Pulse | Saw inv | Saw | Triangle | Sine | Saw 2 | Saw 1 | Sqr 2 | Sqr 1 | Saw 1 / match | Saw 2 / match | +15V | -15V | GND | Timer in | +5V